# EAGLE design AMI_601 (EAGLE 6.1)
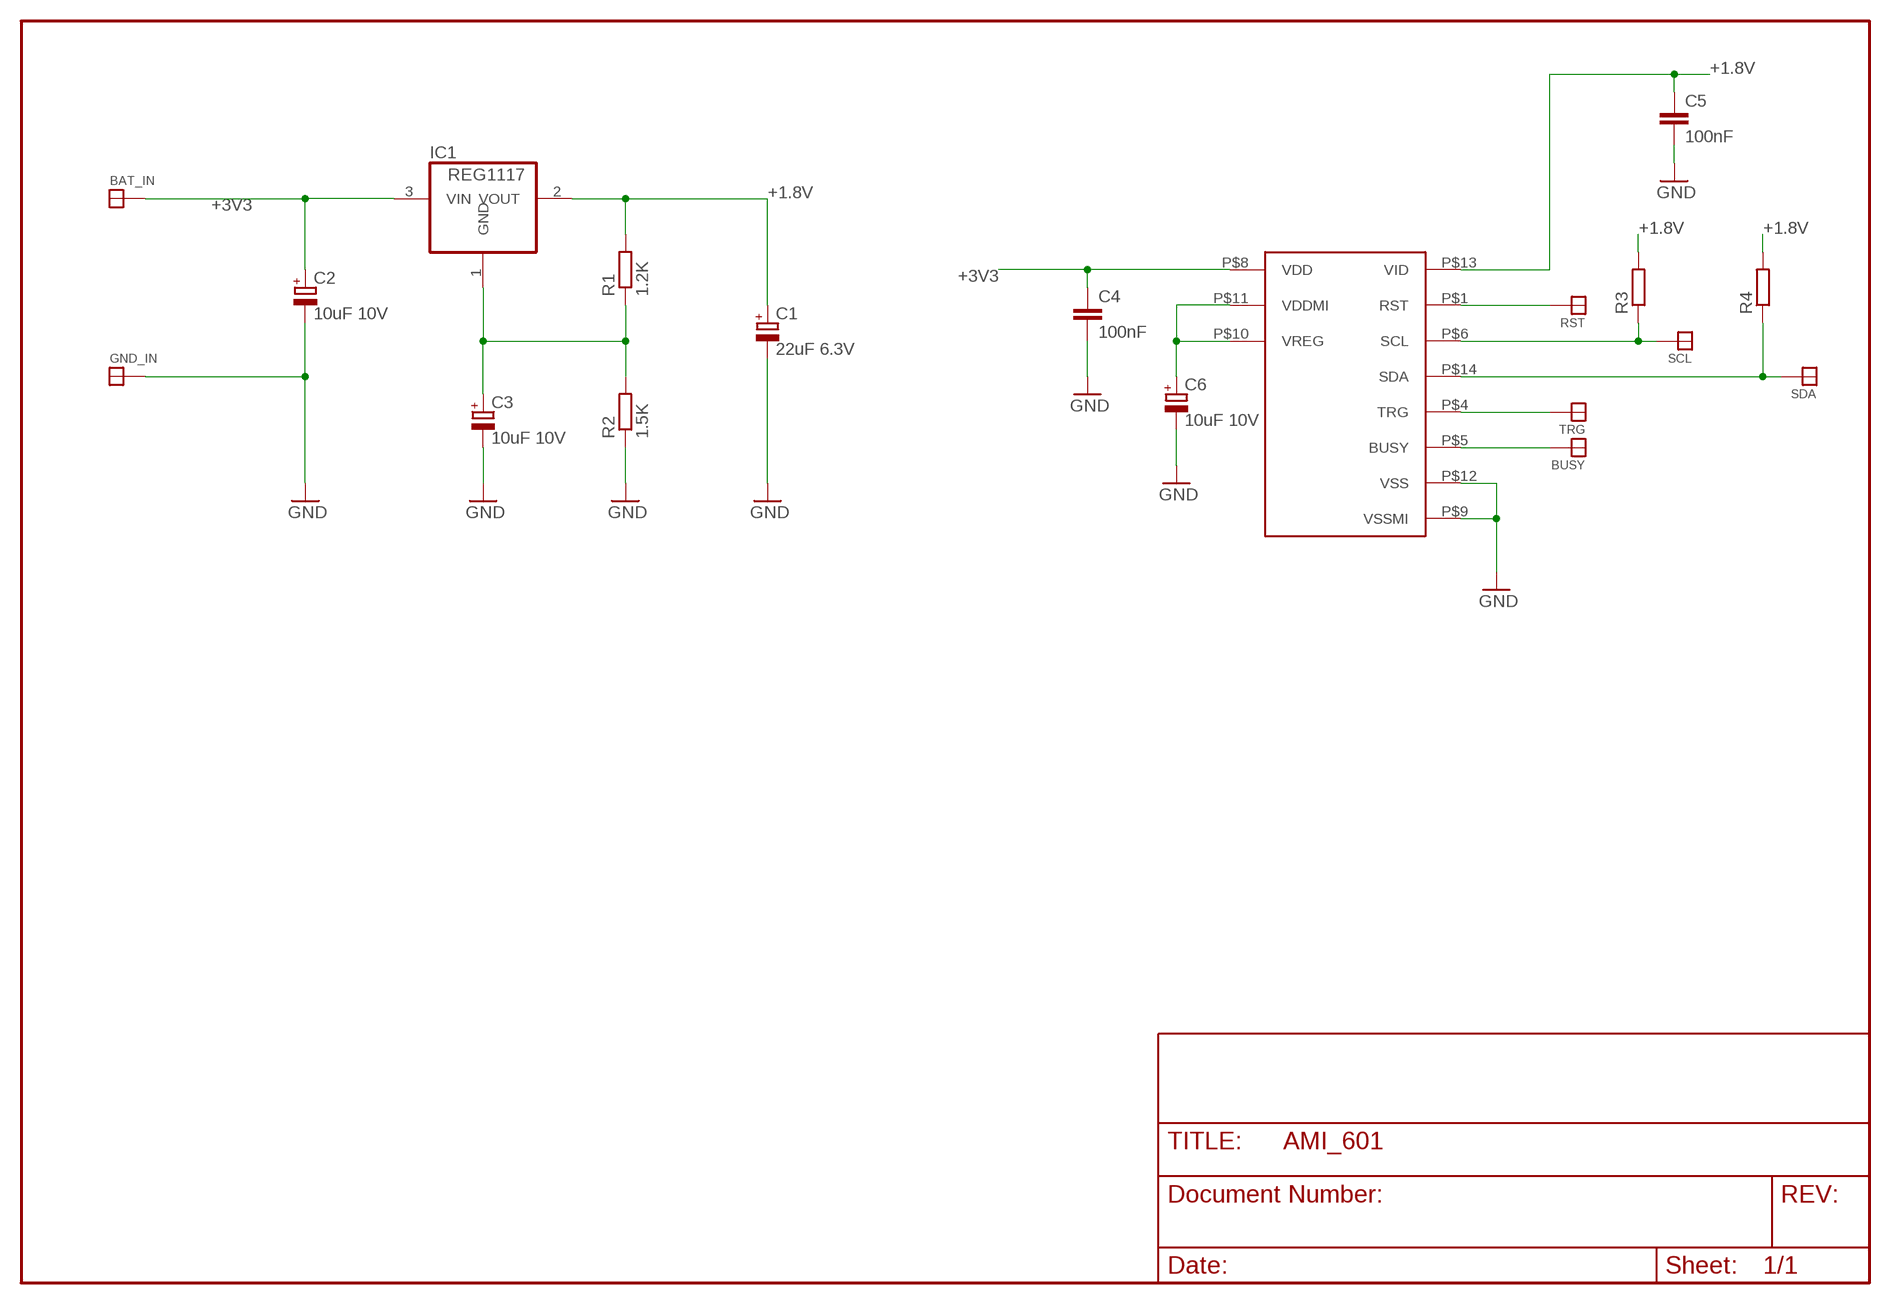
[diagram p0: schematic, sheet 1]

## Parts
BAT_IN  SOLDER_PAD150_75  [SOLD_PAD_150_75]
BUSY  SOLDER_PAD150_75  [SOLD_PAD_150_75]
C1  22uF 6.3V  CPOL-EUCT3528  [CT3528]
C2  10uF 10V  CPOL-EUCT3216  [CT3216]
C3  10uF 10V  CPOL-EUCT3216  [CT3216]
C4  100nF  C-EUC0805K  [C0805K]
C5  100nF  C-EUC0805K  [C0805K]
C6  10uF 10V  CPOL-EUCT3216  [CT3216]
GND_IN  SOLDER_PAD150_75  [SOLD_PAD_150_75]
IC1  REG1117  [SOT223]
R1  1.2K  R-EU_M0805  [M0805]
R2  1.5K  R-EU_M0805  [M0805]
R3  R-EU_M0805  [M0805]
R4  R-EU_M0805  [M0805]
RST  SOLDER_PAD150_75  [SOLD_PAD_150_75]
SCL  SOLDER_PAD150_75  [SOLD_PAD_150_75]
SDA  SOLDER_PAD150_75  [SOLD_PAD_150_75]
TRG  SOLDER_PAD150_75  [SOLD_PAD_150_75]
U$1  AMI601  [AMI_601]

## Nets
+1.8V: C1.+ C5.1 IC1.2(VOUT) R1.2 R3.2 R4.2 U$1.P$13(VID)
+3V3: BAT_IN.P$1 C2.+ C4.1 IC1.3(VIN) U$1.P$8(VDD)
GND: C1.- C2.- C3.- C4.2 C5.2 C6.- GND_IN.P$1 R2.1 U$1.P$9(VSSMI) U$1.P$12(VSS)
N$1: C3.+ IC1.1(GND) R1.1 R2.2
N$2: C6.+ U$1.P$10(VREG) U$1.P$11(VDDMI)
N$3: RST.P$1 U$1.P$1(RST)
N$4: R3.1 SCL.P$1 U$1.P$6(SCL)
N$5: R4.1 SDA.P$1 U$1.P$14(SDA)
N$6: TRG.P$1 U$1.P$4(TRG)
N$7: BUSY.P$1 U$1.P$5(BUSY)

## Library data of the parts
BAT_IN BUSY GND_IN RST SCL SDA TRG = paparazzi:SOLDER_PAD
C1-C3 C6 = rcl:CPOL-EU: POLARIZED CAPACITOR, European symbol
C4 C5 = rcl:C-EU: CAPACITOR, European symbol
IC1 = burr-brown:REG1117: 800mA and 1A Low Dropout (LDO) Positive Regulator 1.8V, 2.5V, 2.85V, 3.3V, 5V, and Adj
R1-R4 = rcl:R-EU_: RESISTOR, European symbol
U$1 = paparazzi:AMI601

## Board
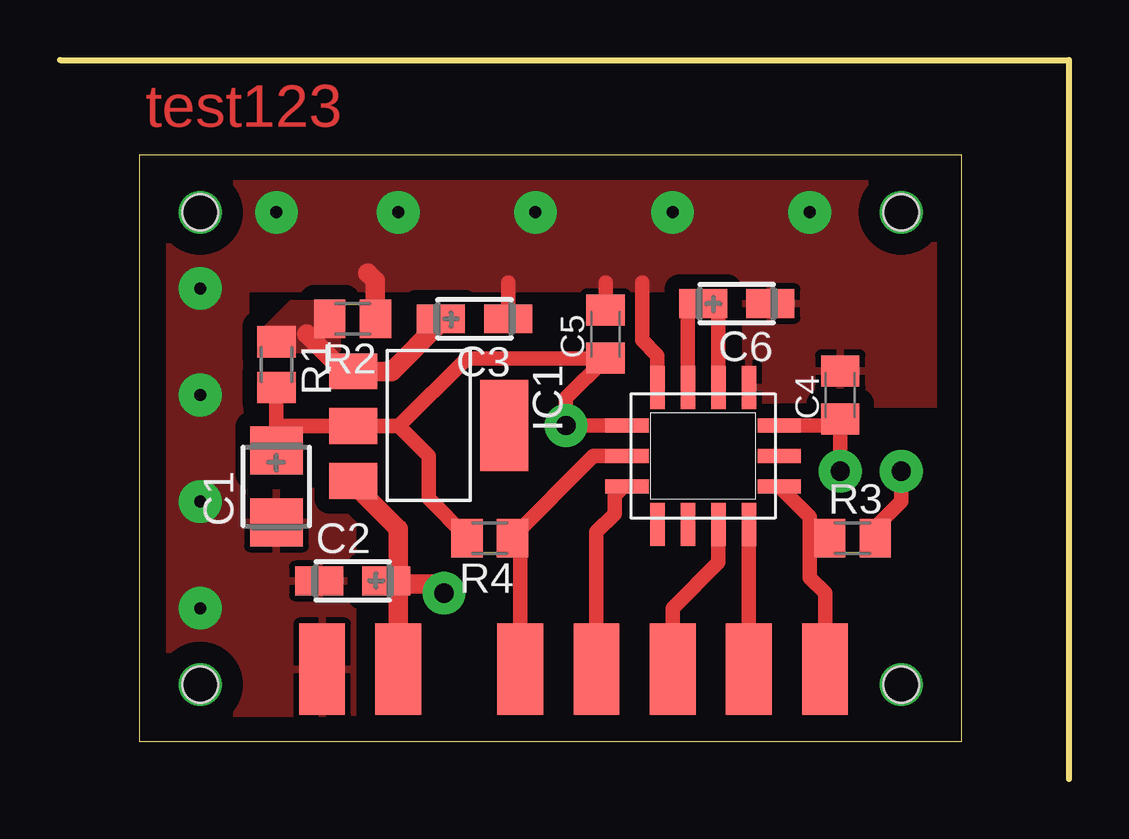
[diagram p1: board, top side]
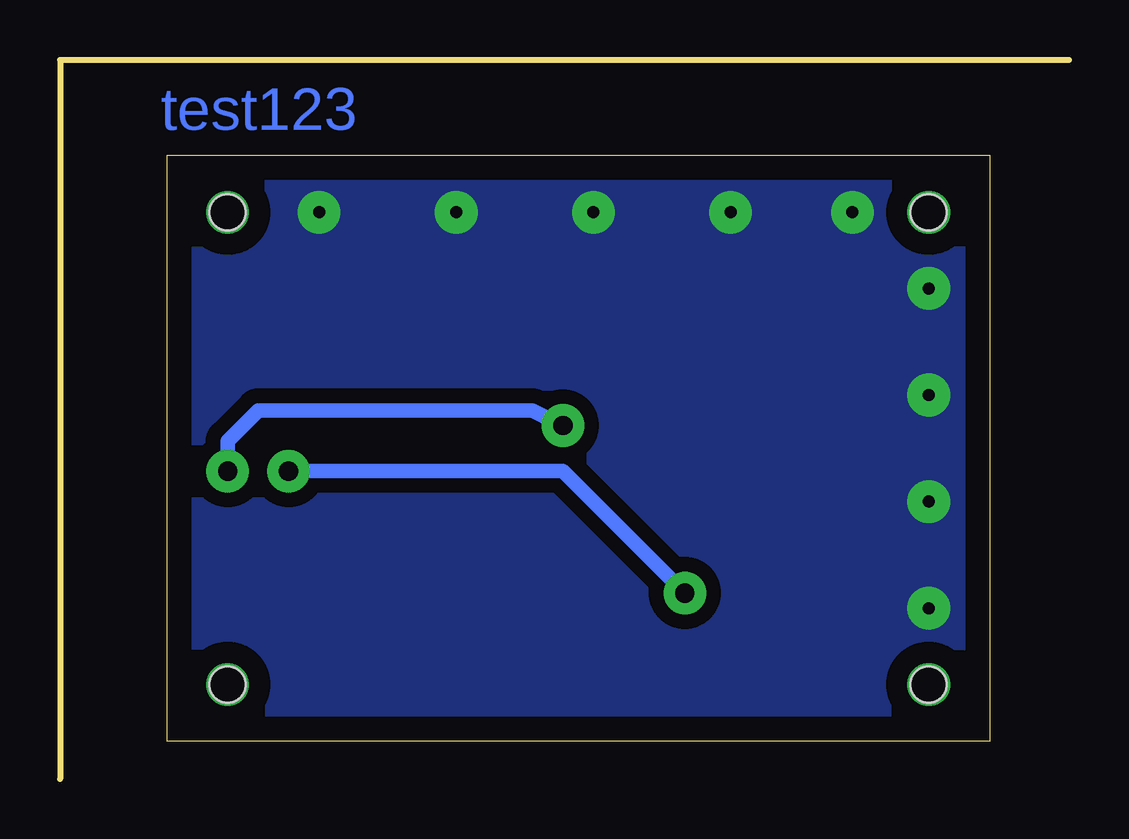
[diagram p2: board, bottom side, seen from below]

Size 42.04 x 29.97 mm. Coordinates in mm from the lower left corner, seen from the top.
Outline: 0,29.97 42.04,29.97 42.04,0
Outline: 3.31,1.56 37.58,1.56 37.58,26 3.31,26 3.31,1.56
Copper layers (1*16): Top 0.035mm / dielectric 1.5mm / Bottom 0.035mm
Design rules: minimum track width 10mil, minimum drill 24mil, track to track 8mil, track to pad 8mil, pad to pad 8mil, via to via 8mil, smd to smd 8mil, copper to edge 40mil, drill to drill 8mil, minimum pad ring 10mil, minimum via ring 8mil, stop-mask expansion 4mil, vias tented up to drill 0mil, thermal gap 10mil
Holes 1.5 mm at 35.05,23.62 5.84,23.62 5.84,3.94 35.05,3.94

### Footprints (pad centres in the part's own frame; a part is rotated, then mirrored left to right if it is on the bottom)
SOLD_PAD_150_75 = smd 3.81 x 1.905: P$1 0,0
CT3528 = smd 2 x 2.2: + 1.5,0; - -1.5,0
CT3216 = smd 2 x 1.2: + 1.4,0; - -1.4,0
C0805K = smd 1.3 x 1.6: 1 -1,0; 2 1,0
SOT223 = smd 1.499 x 2.007: 1 -2.261,-3.15; 2 0.025,-3.15; 3 2.311,-3.15 | smd 3.81 x 2.007: 4 0,3.15
M0805 = smd 1.3 x 1.6: 1 -0.95,0; 2 0.95,0
AMI_601 = smd 1.8 x 0.6: P$1 -3.175,-1.27; P$6 3.175,-1.27; P$7 3.175,0; P$8 3.175,1.27; P$13 -3.175,1.27; P$14 -3.175,0 | smd 0.6 x 1.8: P$2 -1.905,-2.857; P$3 -0.635,-2.857; P$4 0.635,-2.857; P$5 1.905,-2.857; P$9 1.905,2.857; P$10 0.635,2.857; P$11 -0.635,2.857; P$12 -1.905,2.857

### Placement (x,y rotation side)
BAT_IN  14.1,4.57 90 top
BUSY  28.7,4.57 90 top
C1  9.02,12.19 90 top
C2  12.19,8.25 0 top
C3  17.27,19.18 180 top
C4  32.51,16 90 top
C5  22.73,18.54 90 top
C6  28.19,19.81 180 top
GND_IN  10.92,4.57 90 top
IC1  15.37,14.73 270 top
R1  9.02,17.27 270 top
R2  12.19,19.18 180 top
R3  33.02,10.03 0 top
R4  17.91,10.03 180 top
RST  22.35,4.57 90 top
SCL  31.88,4.57 90 top
SDA  19.18,4.57 90 top
TRG  25.53,4.57 90 top
U$1  26.8,13.46 0 top

### Tracks (layer width: path | path; a pad name or v marks a point on that pad's centre or on a via)
+1.8V  (via drill 0.8 pad 1.78)
  Top 0.61: 9.02,13.46 C1.+ 9.02,14.73 | 9.02,14.73 R1.2 | 9.02,14.73 9.02,14.71 IC1.2 14.12,14.71 | 14.12,14.71 15.37,13.46 15.37,11.68 16.96,10.09 R4.2 | 14.12,14.71 16.94,17.53 22.73,17.53 | R3.2 33.78,10.29 35.05,11.56 v35.05,12.83 | U$1.P$13 v21.08,14.73 21.08,15.88 22.73,17.53 | 22.73,17.65 C5.1 22.73,17.53
  Bottom 0.61: v35.05,12.83 35.05,14.1 33.78,15.37 22.35,15.37 v21.08,14.73
+3V3  (via drill 0.8 pad 1.78)
  Top 0.61: v32.51,12.83 32.51,14.73 | C2.+ 14.23,8.51 14.22,8.51 14.1,8.38 14.1,8.13 | 15.62,8.13 v16,7.75 | 32.51,14.73 C4.1 | 32.51,14.73 U$1.P$8
  Top 0.813: BAT_IN.P$1 14.1,8.13 | 14.1,8.13 15.62,8.13 | IC1.3 12.22,12.29 14.1,10.41 14.1,8.13
  Bottom 0.61: v16,7.75 21.08,12.83 v32.51,12.83
GND  (via drill 0.5 pad 1.78)
  Top 0.61: C3.- 18.67,20.7 | C5.2 22.73,20.7 | U$1.P$12 24.89,17.65 24.26,18.29 24.26,20.7
  Top 0.813: R2.1 13.14,20.77 12.83,21.08
  other vias: 5.84,7.11 5.84,11.56 5.84,16 5.84,20.45 9.02,23.62 14.1,23.62 19.81,23.62 25.53,23.62 31.24,23.62
  pour Top (isolate 0.61): 4.57,2.67 4.57,24.89 36.96,24.89 36.96,15.62 28.58,15.62 28.58,20.45 7.75,20.45 7.75,16 12.19,16 12.19,2.67
  pour Bottom (isolate 0.61): 2.67,25.53 36.96,25.53 36.96,2.03 2.67,2.03
N$1
  Top 0.813: 10.29,18.54 11.84,16.99 IC1.1 13.82,16.99 15.87,19.05 C3.+
  pour Top (isolate 0.61, no thermals): 8.38,17.91 8.38,18.54 9.65,19.81 11.56,19.81 11.56,17.91
N$2
  Top 0.61: 26.16,19.81 U$1.P$11 | U$1.P$10 27.43,19.81 C6.+ | 26.16,19.81 C6.+ | C6.+ 26.16,19.81
N$3
  Top 0.61: RST.P$1 22.35,10.29 23.11,11.05 23.11,11.81 23.49,12.19 U$1.P$1
N$4
  Top 0.61: SCL.P$1 31.88,7.75 31.24,8.38 31.24,10.29 | 31.24,10.29 R3.1 | 31.24,10.29 31.24,10.92 U$1.P$6
N$5
  Top 0.61: U$1.P$14 22.23,13.46 18.8,10.03 R4.1 18.86,9.97 18.8,9.91 19.18,9.53 SDA.P$1
N$6
  Top 0.61: U$1.P$4 27.43,9.02 25.53,7.11 TRG.P$1
N$7
  Top 0.61: BUSY.P$1 U$1.P$5
N$9  (via drill 0.8 pad 1.78)
  other vias: 5.84,23.62
N$11  (via drill 0.8 pad 1.78)
  other vias: 35.05,23.62
N$12  (via drill 0.8 pad 1.78)
  other vias: 35.05,3.94
N$14  (via drill 0.8 pad 1.78)
  other vias: 5.84,3.94

### Text on the board
Top: test123
Bottom: test123